# Altium schematic sheet 07-AD9546_Outputs.SchDoc
size A; SheetNumber: 7; SheetTotal: 16
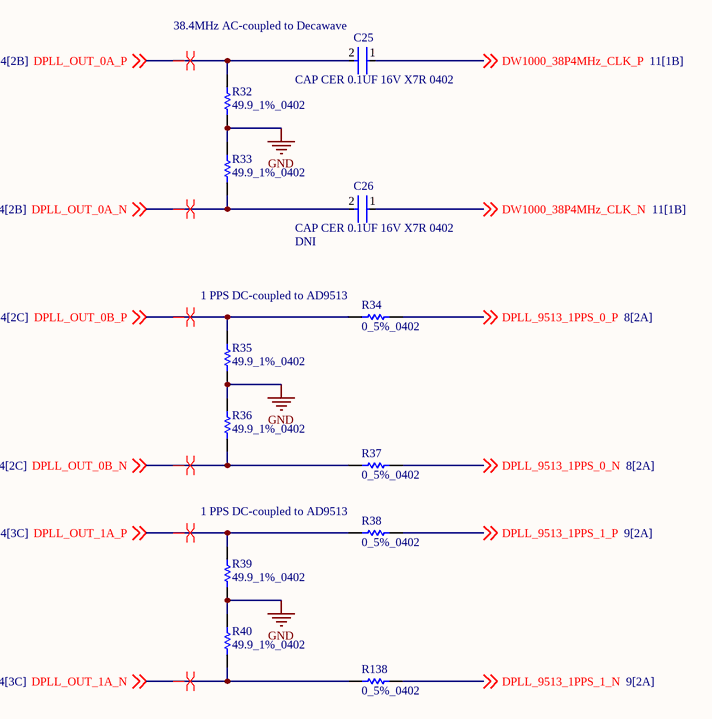
[diagram p0: 07-AD9546_Outputs.SchDoc]

## Parts
C25  GRM155R71C104KA88D  [FP-GRM15-MFG]  (value not drawn)
C26  GRM155R71C104KA88D  [FP-GRM15-MFG]  (value not drawn)
R32  49.9_1%_0402  [RESC1005X40X25NL05T05]
R33  49.9_1%_0402  [RESC1005X40X25NL05T05]
R34  0_5%_0402  [RESC1005X40X25LL10T10]
R35  49.9_1%_0402  [RESC1005X40X25NL05T05]
R36  49.9_1%_0402  [RESC1005X40X25NL05T05]
R37  0_5%_0402  [RESC1005X40X25LL10T10]
R38  0_5%_0402  [RESC1005X40X25LL10T10]
R39  49.9_1%_0402  [RESC1005X40X25NL05T05]
R40  49.9_1%_0402  [RESC1005X40X25NL05T05]
R138  0_5%_0402  [RESC1005X40X25LL10T10]

## Nets
GND: R32.1 R33.2 R35.1 R36.2 R39.1 R40.2
DPLL_9513_1PPS_0_N: R37.2 ; off-sheet DPLL_9513_1PPS_0_N
DPLL_9513_1PPS_0_P: R34.2 ; off-sheet DPLL_9513_1PPS_0_P
DPLL_9513_1PPS_1_N: R138.2 ; off-sheet DPLL_9513_1PPS_1_N
DPLL_9513_1PPS_1_P: R38.2 ; off-sheet DPLL_9513_1PPS_1_P
DPLL_OUT_0A_N: C26.2 R33.1 ; off-sheet DPLL_OUT_0A_N
DPLL_OUT_0A_P: C25.2 R32.2 ; off-sheet DPLL_OUT_0A_P
DPLL_OUT_0B_N: R36.1 R37.1 ; off-sheet DPLL_OUT_0B_N
DPLL_OUT_0B_P: R34.1 R35.2 ; off-sheet DPLL_OUT_0B_P
DPLL_OUT_1A_N: R40.1 R138.1 ; off-sheet DPLL_OUT_1A_N
DPLL_OUT_1A_P: R38.1 R39.2 ; off-sheet DPLL_OUT_1A_P
DW1000_38P4MHz_CLK_N: C26.1 ; off-sheet DW1000_38P4MHz_CLK_N
DW1000_38P4MHz_CLK_P: C25.1 ; off-sheet DW1000_38P4MHz_CLK_P

## Layout directives
differential pair: DPLL_OUT_0A_N, DPLL_OUT_0A_P, DPLL_OUT_0B_N, DPLL_OUT_0B_P, DPLL_OUT_1A_N, DPLL_OUT_1A_P

## Notes on the sheet
- (near C25) 38.4MHz AC-coupled to Decawave
- (near R34) 1 PPS DC-coupled to AD9513
- (near R38) 1 PPS DC-coupled to AD9513

## Library data of the parts
C25 C26 = CMP-2100-03641-2: CAP CER 0.1UF 16V X7R 0402; Manufacturer: Murata; Standoff Height: 0mm; Tolerance: 10%; Voltage Rating: 16Vdc; Material: Ceramic; Capacitance: 0.10μF; Value: 0.10μF; RoHS: TRUE; Manufacturer Part Number: GRM155R71C104KA88D; Temperature Characteristic: X7R; Octopart: https://octopart.com/grm155r71c104ka88d-murata-196880; Digikey Description: CAP CER 0.1UF 16V X7R 0402; Device Class L3: Ceramic Capacitors; Height: 0.55mm; ComponentLink2Description: Datasheet; Temperature Range Low: -55°C; Ipc Land Pattern Name: CAPC10050X219; ComponentLink2URL: https://search.murata.co.jp/Ceramy/image/img/A01X/G101/ENG/GRM155R71H471KA01-01A.pdf; Device Class L1: Passive Components; Lead Free: yes; Category: Cap; Package: GRM15; Temperature: -55°C to +125°C; Device Class L2: Capacitors; Temperature Range High: +125°C; Mouser Description: 0402 0.1 uF 16V ±10 % Tolerance X7R SMT Multilayer Ceramic Capacitor
  C26: DNI: DNI
R32 R33 R35 R36 R39 R40 = CMP-2002-00969-1: Manufacturer: Panasonic; Part Number: ERJ-2RKF49R9X
R34 R37 R38 R138 = CMP-2002-04569-1: Manufacturer: KOA Speer; Part Number: RK73Z1ETTP